# EAGLE schematic S130068_3HP_ECO (EAGLE 6.5.0)

## Sheet 1 of 4
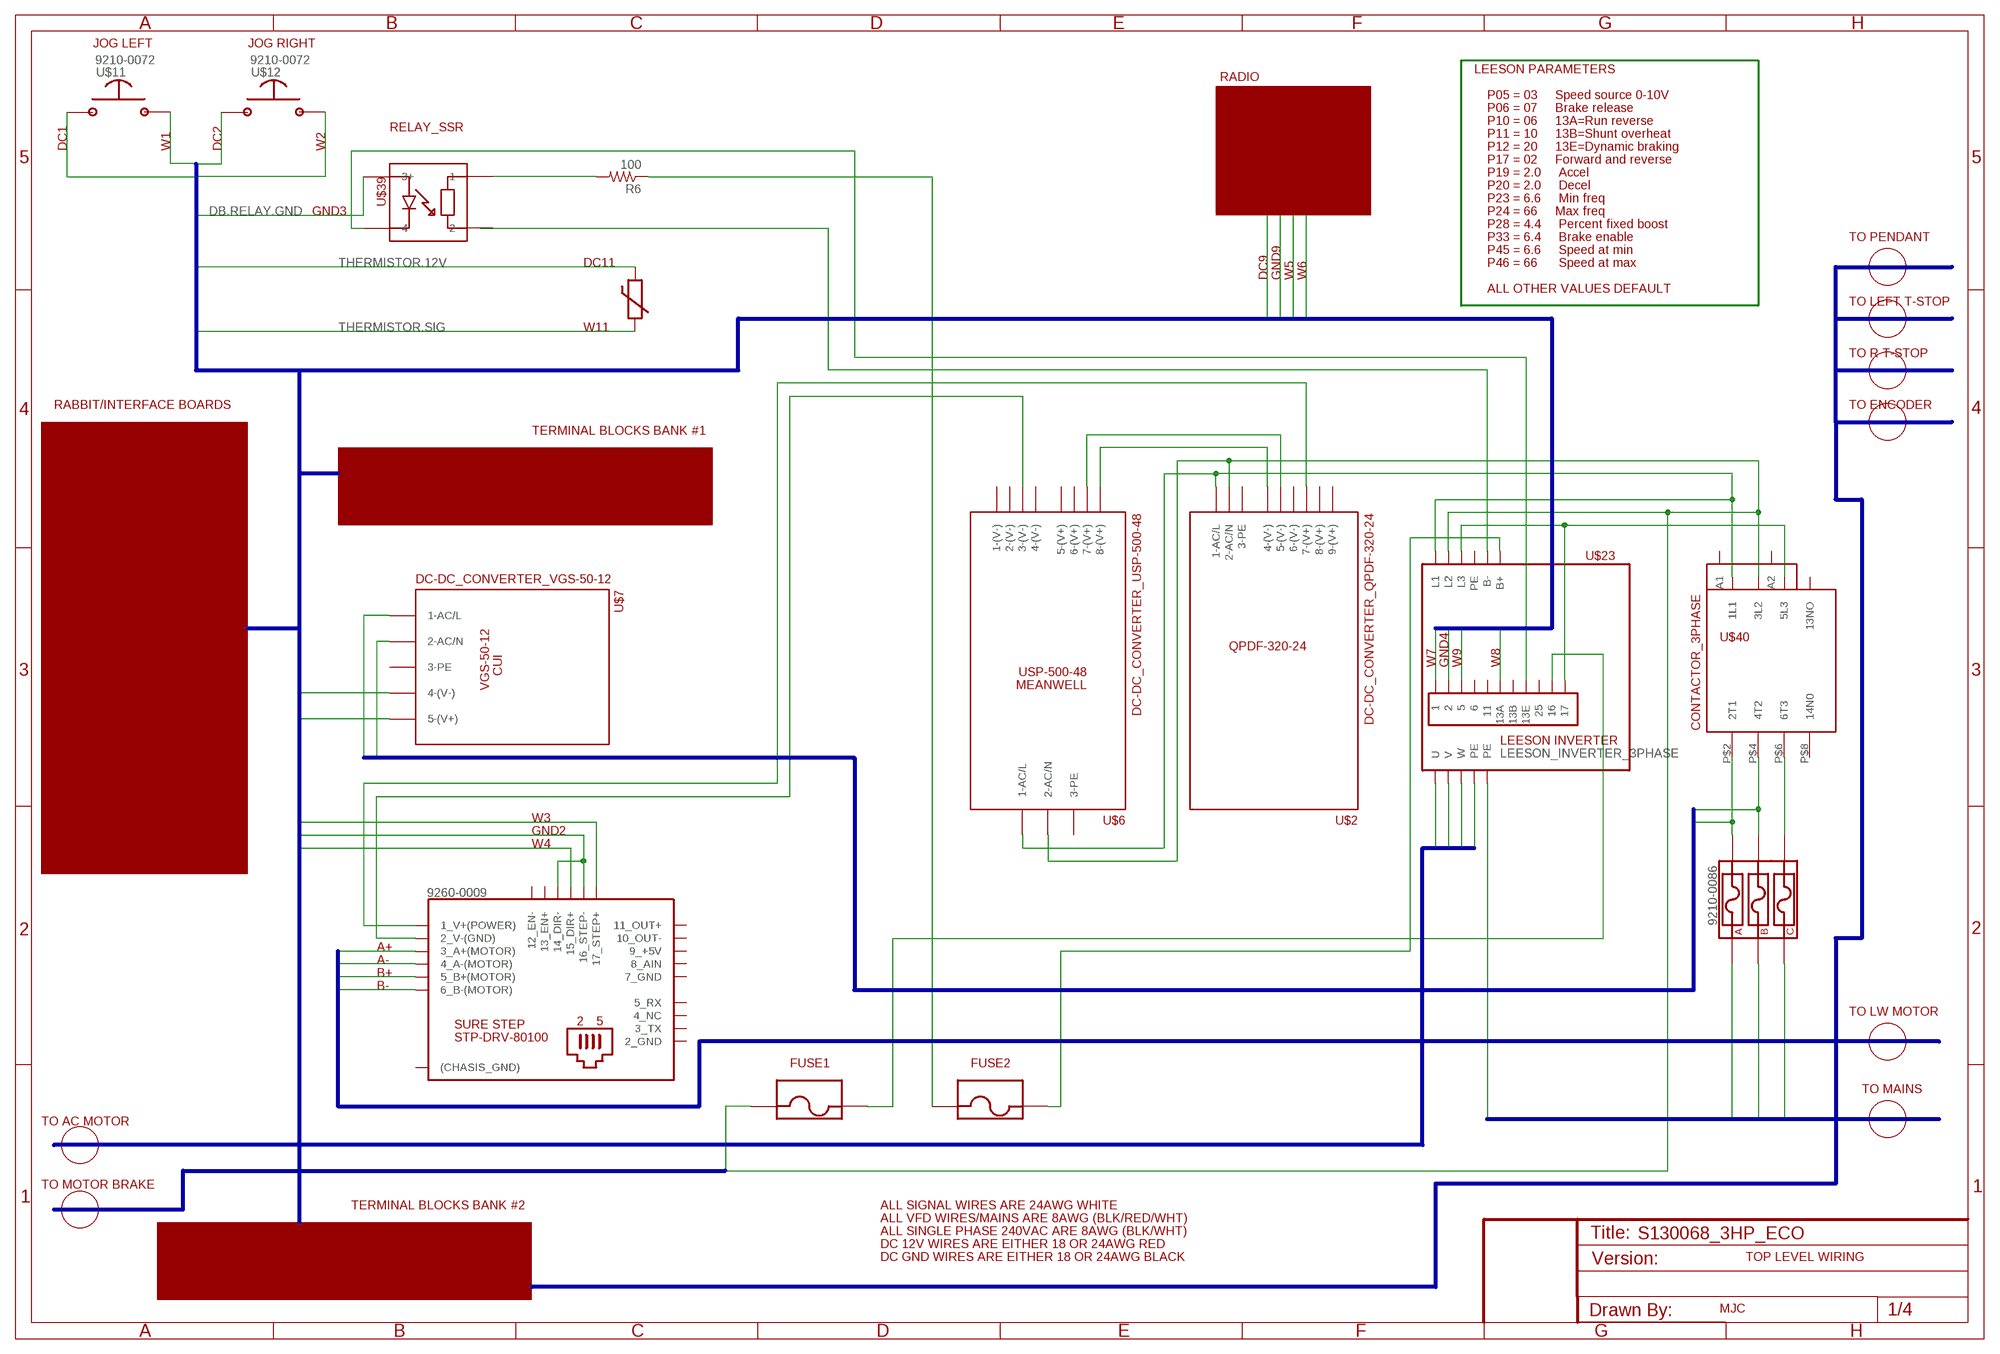
[diagram p0: schematic, sheet 1]

### Parts
R6  100  R-US_V234/12  [V234/12]
U$2  DC-DC_CONVERTER_QPDF-320-24  [BOGUS]
U$6  DC-DC_CONVERTER_USP-500-48  [BOGUS]
U$7  DC-DC_CONVERTER_VGS-50-12  [BOGUS]
U$8  THERMISTOR  [BOGUS]
U$9  TERMINAL_BLOCK_FUSED  [BOGUS]
U$10  TERMINAL_BLOCK_FUSED  [BOGUS]
U$11  SWITCH_MOM_NO  [BOGUS]
U$12  SWITCH_MOM_NO  [BOGUS]
U$13  SURE_STEP_STP-DRV-80100  [BOGUS]
U$23  LEESON_INVERTER_3PHASE  [BOGUS]
U$38  FUSE_HOLDER_3-POLE  [BOGUS]
U$39  RELAY_SSR  [BOGUS]
U$40  CONTACTOR_3PHASE  [BOGUS]

### Nets
B$1: U$23.P$19(PE) U$38.P$1 U$38.P$2 U$38.P$5
B$2: U$23.P$18(PE) U$23.P$20(U) U$23.P$21(V) U$23.P$22(W)
B$7: U$13.P$4(3_A+(MOTOR)) U$13.P$5(4_A-(MOTOR)) U$13.P$6(5_B+(MOTOR)) U$13.P$7(6_B-(MOTOR))
B$8: U$7.P$1(1-AC/L) U$7.P$2(2-AC/N) U$38.P$3 U$38.P$4 U$40.P$2(2T1) U$40.P$4(4T2)
B$9: U$7.P$4(4-(V-)) U$7.P$5(5-(V+)) U$11.P$1 U$11.P$2 U$12.P$1 U$13.P$15(14_DIR-) U$13.P$16(15_DIR+) U$13.P$17(16_STEP-) U$13.P$18(17_STEP+) U$23.P$1 U$23.P$2 U$23.P$3 U$23.P$6(13A)
B$10: U$2.P$2(2-AC/N) U$6.P$4(2-AC/N) U$9.P$2 U$23.P$15(L2) U$40.P$3(3L2)
DB.RELAY.GND: U$39.P$3(3+) ; also sheet 2
N$4: U$23.P$10 U$23.P$16(L3) U$40.P$5(5L3)
N$11: U$23.P$13(B-)
N$24: U$38.P$6 U$40.P$6(6T3)
N$27: U$2.P$1(1-AC/L) U$6.P$2(1-AC/L) U$23.P$14(L1) U$40.P$1(1L1)
N$31: R6.2 U$39.P$1
N$32: U$2.P$4(4-(V-)) U$6.P$11(8-(V+))
N$33: U$39.P$4
N$34: U$12.P$2
N$35: R6.1 U$10.P$2
N$36: U$10.P$1 U$23.P$12(B+)
N$37: U$9.P$1 U$23.P$9
N$39: U$2.P$5(5-(V-)) U$6.P$10(7-(V+))
N$40: U$2.P$7(7-(V+)) U$13.P$2(1_V+(POWER))
N$41: U$6.P$5(3-(V-)) U$13.P$3(2_V-(GND))
THERMISTOR.12V: U$8.P$2 ; also sheet 2
THERMISTOR.SIG: U$8.P$1 ; also sheet 2,4
Unconnected: U$2.P$3(3-PE) U$2.P$6(6-(V-)) U$2.P$8(8-(V+)) U$2.P$9(9-(V+)) U$6.P$1(1-(V-)) U$6.P$3(2-(V-)) U$6.P$6(3-PE) U$6.P$7(4-(V-)) U$6.P$8(5-(V+)) U$6.P$9(6-(V+)) U$7.P$3(3-PE) U$23.P$4 U$23.P$5 U$23.P$7(13B) U$23.P$8(13E) U$23.P$11 U$39.P$2 U$40.P$7(13NO) U$40.P$8(14N0) U$40.P$9(A1) U$40.P$10(A2)

### Buses
B$1
B$2
B$6
B$7
B$8
B$9
B$10

### Notes on the sheet
- JOG LEFT | JOG RIGHT
- LEESON PARAMETERS
- RADIO
- P05 = 03     Speed source 0-10V
- P06 = 07     Brake release
- P10 = 06     13A=Run reverse
- P11 = 10     13B=Shunt overheat
- DC1 | W1 | DC2 | W2 | P12 = 20     13E=Dynamic braking
- P17 = 02     Forward and reverse
- P19 = 2.0     Accel
- P20 = 2.0     Decel
- P23 = 6.6     Min freq
- GND3 | P24 = 66     Max freq
- P28 = 4.4     Percent fixed boost
- P33 = 6.4     Brake enable | TO PENDANT
- P45 = 6.6     Speed at min
- DC11 | P46 = 66      Speed at max
- DC9 | GND9 | W5 | W6
- ALL OTHER VALUES DEFAULT
- TO LEFT T-STOP
- W11
- TO R T-STOP
- RABBIT/INTERFACE BOARDS | TO ENCODER
- TERMINAL BLOCKS BANK #1
- W7 | GND4 | W9 | W8
- W3
- GND2
- W4
- A+
- A-
- B+
- B-
- TO LW MOTOR
- FUSE1 | FUSE2
- TO MAINS
- TO AC MOTOR
- TO MOTOR BRAKE
- TERMINAL BLOCKS BANK #2 | ALL SIGNAL WIRES ARE 24AWG WHITE
- ALL VFD WIRES/MAINS ARE 8AWG (BLK/RED/WHT)
- ALL SINGLE PHASE 240VAC ARE 8AWG (BLK/WHT)
- DC 12V WIRES ARE EITHER 18 OR 24AWG RED
- DC GND WIRES ARE EITHER 18 OR 24AWG BLACK | TOP LEVEL WIRING
- MJC

## Sheet 2 of 4
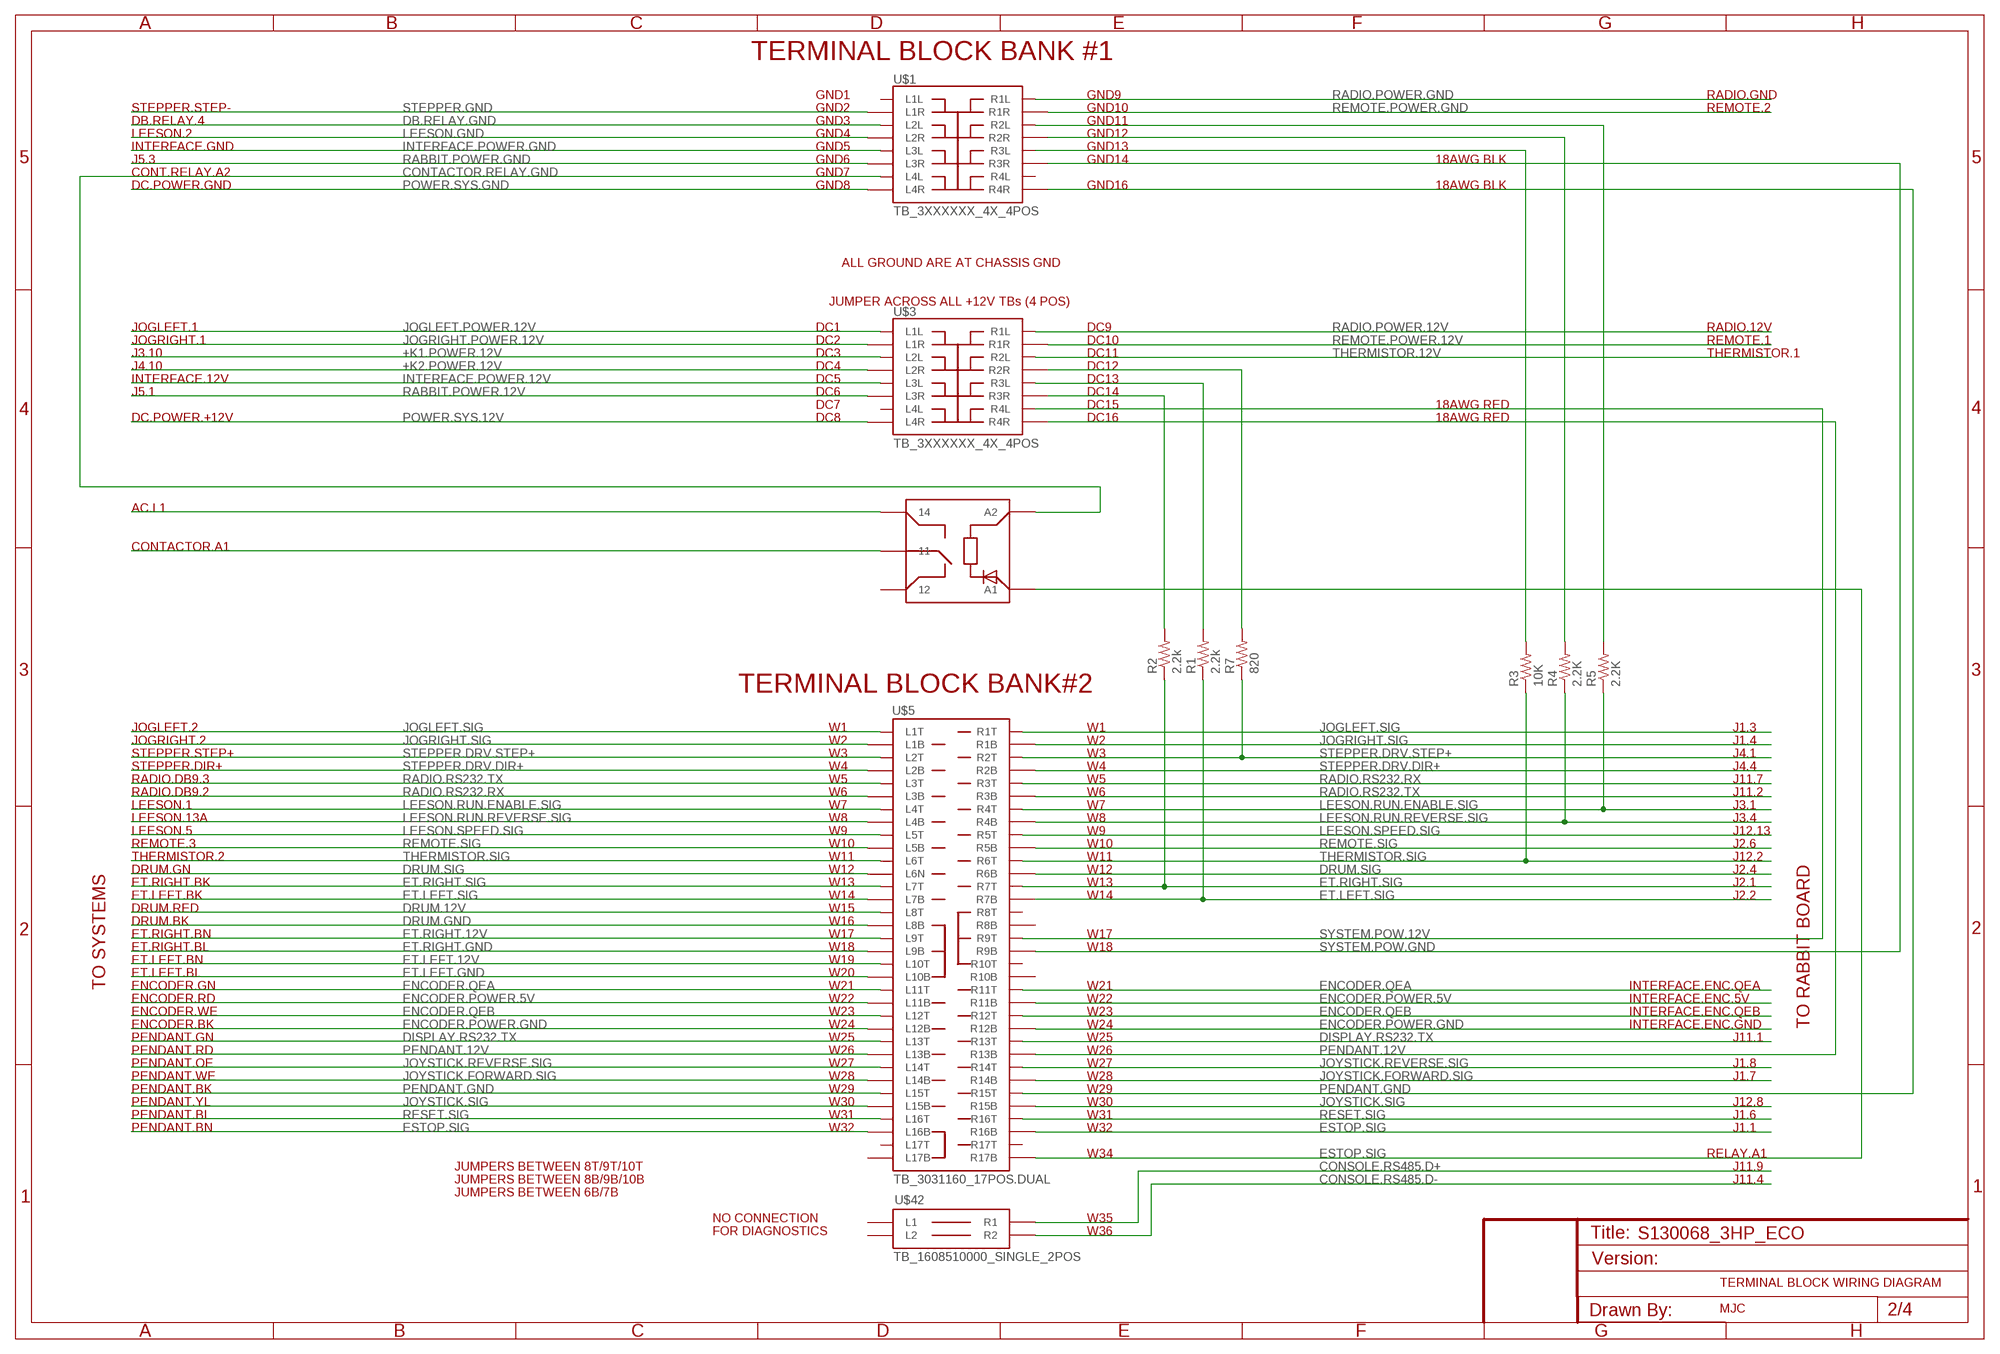
[diagram p1: schematic, sheet 2]

### Parts
R1  2.2k  R-US_V234/12  [V234/12]
R2  2.2k  R-US_V234/12  [V234/12]
R3  10K  R-US_V234/12  [V234/12]
R4  2.2K  R-US_V234/12  [V234/12]
R5  2.2K  R-US_V234/12  [V234/12]
R7  820  R-US_V234/12  [V234/12]
U$1  TB_3XXXXXX_4X_4POS  [BOGUS]
U$3  TB_3XXXXXX_4X_4POS  [BOGUS]
U$4  RELAY_TB  [BOGUS]
U$5  TB_3031160_17POS.DUAL  [BOGUS]
U$42  TB_1608510000_SINGLE_2POS  [BOGUS]

### Nets
+K1.POWER.12V: U$3.P$3(L2L) ; also sheet 4
+K2.POWER.12V: U$3.P$4(L2R) ; also sheet 4
CONSOLE.RS485.D+: U$42.P$3(R1) ; also sheet 4
CONSOLE.RS485.D-: U$42.P$4(R2) ; also sheet 4
CONTACTOR.RELAY.GND: U$1.P$7(L4L) U$4.P$5(A2)
DB.RELAY.GND: U$1.P$3(L2L) ; also sheet 1
DISPLAY.RS232.TX: U$5.P$26(L13T) U$5.P$60(R13T) ; also sheet 3,4
DRUM.12V: U$5.P$16(L8T)
DRUM.GND: U$5.P$15(L8B)
DRUM.SIG: U$5.P$11(L6N) U$5.P$45(R6B) ; also sheet 4
ENCODER.POWER.5V: U$5.P$21(L11B) U$5.P$55(R11B)
ENCODER.POWER.GND: U$5.P$23(L12B) U$5.P$57(R12B)
ENCODER.QEA: U$5.P$22(L11T) U$5.P$56(R11T)
ENCODER.QEB: U$5.P$24(L12T) U$5.P$58(R12T)
ESTOP.SIG: U$4.P$4(A1) U$5.P$31(L16B) U$5.P$65(R16B) U$5.P$67(R17B) ; also sheet 3,4
ET.LEFT.12V: U$5.P$20(L10T)
ET.LEFT.GND: U$5.P$19(L10B)
ET.LEFT.SIG: R1.1 U$5.P$13(L7B) U$5.P$47(R7B) ; also sheet 4
ET.RIGHT.12V: U$5.P$18(L9T)
ET.RIGHT.GND: U$5.P$17(L9B)
ET.RIGHT.SIG: R2.1 U$5.P$14(L7T) U$5.P$48(R7T) ; also sheet 4
INTERFACE.POWER.12V: U$3.P$5(L3L) ; also sheet 4
INTERFACE.POWER.GND: U$1.P$5(L3L) ; also sheet 4
JOGLEFT.POWER.12V: U$3.P$1(L1L)
JOGLEFT.SIG: U$5.P$2(L1T) U$5.P$36(R1T) ; also sheet 4
JOGRIGHT.POWER.12V: U$3.P$2(L1R)
JOGRIGHT.SIG: U$5.P$1(L1B) U$5.P$35(R1B) ; also sheet 4
JOYSTICK.FORWARD.SIG: U$5.P$27(L14B) U$5.P$61(R14B) ; also sheet 3,4
JOYSTICK.REVERSE.SIG: U$5.P$28(L14T) U$5.P$62(R14T) ; also sheet 3,4
JOYSTICK.SIG: U$5.P$29(L15B) U$5.P$63(R15B) ; also sheet 3,4
LEESON.GND: U$1.P$4(L2R)
LEESON.RUN.ENABLE.SIG: R5.1 U$5.P$8(L4T) U$5.P$42(R4T) ; also sheet 4
LEESON.RUN.REVERSE.SIG: R4.1 U$5.P$7(L4B) U$5.P$41(R4B) ; also sheet 4
LEESON.SPEED.SIG: U$5.P$10(L5T) U$5.P$44(R5T) ; also sheet 4
N$2: R2.2 U$3.P$14(R3R)
N$3: R1.2 U$3.P$13(R3L)
N$5: R7.2 U$3.P$12(R2R)
N$6: R3.2 U$1.P$13(R3L)
N$7: R4.2 U$1.P$12(R2R)
N$8: R5.2 U$1.P$11(R2L)
N$9: U$4.P$3
N$10: U$4.P$1
PENDANT.12V: U$3.P$16(R4R) U$5.P$25(L13B) U$5.P$59(R13B) ; also sheet 3
PENDANT.GND: U$1.P$16(R4R) U$5.P$30(L15T) U$5.P$64(R15T) ; also sheet 3
POWER.SYS.12V: U$3.P$8(L4R)
POWER.SYS.GND: U$1.P$8(L4R)
RABBIT.POWER.12V: U$3.P$6(L3R) ; also sheet 4
RABBIT.POWER.GND: U$1.P$6(L3R) ; also sheet 4
RADIO.POWER.12V: U$3.P$9(R1L)
RADIO.POWER.GND: U$1.P$9(R1L)
RADIO.RS232.RX: U$5.P$5(L3B) U$5.P$40(R3T) ; also sheet 4
RADIO.RS232.TX: U$5.P$6(L3T) U$5.P$39(R3B) ; also sheet 4
REMOTE.POWER.12V: U$3.P$10(R1R)
REMOTE.POWER.GND: U$1.P$10(R1R)
REMOTE.SIG: U$5.P$9(L5B) U$5.P$43(R5B) ; also sheet 4
RESET.SIG: U$5.P$32(L16T) U$5.P$66(R16T) ; also sheet 3,4
STEPPER.DRV.DIR+: U$5.P$3(L2B) U$5.P$37(R2B) ; also sheet 4
STEPPER.DRV.STEP+: R7.1 U$5.P$4(L2T) U$5.P$38(R2T) ; also sheet 4
STEPPER.GND: U$1.P$2(L1R)
SYSTEM.POW.12V: U$3.P$15(R4L) U$5.P$52(R9T)
SYSTEM.POW.GND: U$1.P$14(R3R) U$5.P$51(R9B)
THERMISTOR.12V: U$3.P$11(R2L) ; also sheet 1
THERMISTOR.SIG: R3.1 U$5.P$12(L6T) U$5.P$46(R6T) ; also sheet 1,4
Unconnected: U$1.P$1(L1L) U$1.P$15(R4L) U$3.P$7(L4L) U$4.P$2 U$5.P$33(L17B) U$5.P$34(L17T) U$5.P$49(R8B) U$5.P$50(R8T) U$5.P$53(R10B) U$5.P$54(R10T) U$5.P$68(R17T) U$42.P$1(L1) U$42.P$2(L2)

### Notes on the sheet
- TERMINAL BLOCK BANK #1
- GND1 | GND9 | RADIO.GND
- STEPPER.STEP- | GND2 | GND10 | REMOTE.2
- DB.RELAY.4 | GND3 | GND11
- LEESON.2 | GND4 | GND12
- INTERFACE.GND | GND5 | GND13
- J5.3 | GND6 | GND14 | 18AWG BLK
- CONT.RELAY.A2 | GND7
- DC.POWER.GND | GND8 | GND16 | 18AWG BLK
- ALL GROUND ARE AT CHASSIS GND
- JUMPER ACROSS ALL +12V TBs (4 POS)
- JOGLEFT.1 | DC1 | DC9 | RADIO.12V
- JOGRIGHT.1 | DC2 | DC10 | REMOTE.1
- J3.10 | DC3 | DC11 | THERMISTOR.1
- J4.10 | DC4 | DC12
- INTERFACE.12V | DC5 | DC13
- J5.1 | DC6 | DC14
- DC7 | DC15 | 18AWG RED
- DC.POWER.+12V | DC8 | DC16 | 18AWG RED
- AC.L1
- CONTACTOR.A1
- TERMINAL BLOCK BANK#2
- JOGLEFT.2 | W1 | W1 | J1.3
- JOGRIGHT.2 | W2 | W2 | J1.4
- STEPPER.STEP+ | W3 | W3 | J4.1
- STEPPER.DIR+ | W4 | W4 | J4.4
- RADIO.DB9.3 | W5 | W5 | J11.7
- RADIO.DB9.2 | W6 | W6 | J11.2
- LEESON.1 | W7 | W7 | J3.1
- LEESON.13A | W8 | W8 | J3.4
- LEESON.5 | W9 | W9 | J12.13
- REMOTE.3 | W10 | W10 | J2.6
- THERMISTOR.2 | W11 | W11 | J12.2
- DRUM.GN | W12 | W12 | J2.4
- ET.RIGHT.BK | W13 | W13 | J2.1
- ET.LEFT.BK | W14 | W14 | J2.2
- DRUM.RED | W15
- DRUM.BK | W16
- ET.RIGHT.BN | W17 | W17
- ET.RIGHT.BL | W18 | W18
- ET.LEFT.BN | W19
- ET.LEFT.BL | W20
- TO SYSTEMS | ENCODER.GN | W21 | W21 | INTERFACE.ENC.QEA
- ENCODER.RD | W22 | W22 | INTERFACE.ENC.5V
- ENCODER.WE | W23 | W23 | INTERFACE.ENC.QEB
- ENCODER.BK | W24 | W24 | INTERFACE.ENC.GND | TO RABBIT BOARD
- PENDANT.GN | W25 | W25 | J11.1
- PENDANT.RD | W26 | W26
- PENDANT.OE | W27 | W27 | J1.8
- PENDANT.WE | W28 | W28 | J1.7
- PENDANT.BK | W29 | W29
- PENDANT.YL | W30 | W30 | J12.8
- PENDANT.BL | W31 | W31 | J1.6
- PENDANT.BN | W32 | W32 | J1.1
- W34 | RELAY.A1
- JUMPERS BETWEEN 8T/9T/10T | J11.9
- JUMPERS BETWEEN 8B/9B/10B | J11.4
- JUMPERS BETWEEN 6B/7B
- NO CONNECTION | W35
- FOR DIAGNOSTICS | W36
- TERMINAL BLOCK WIRING DIAGRAM
- MJC

## Sheet 3 of 4
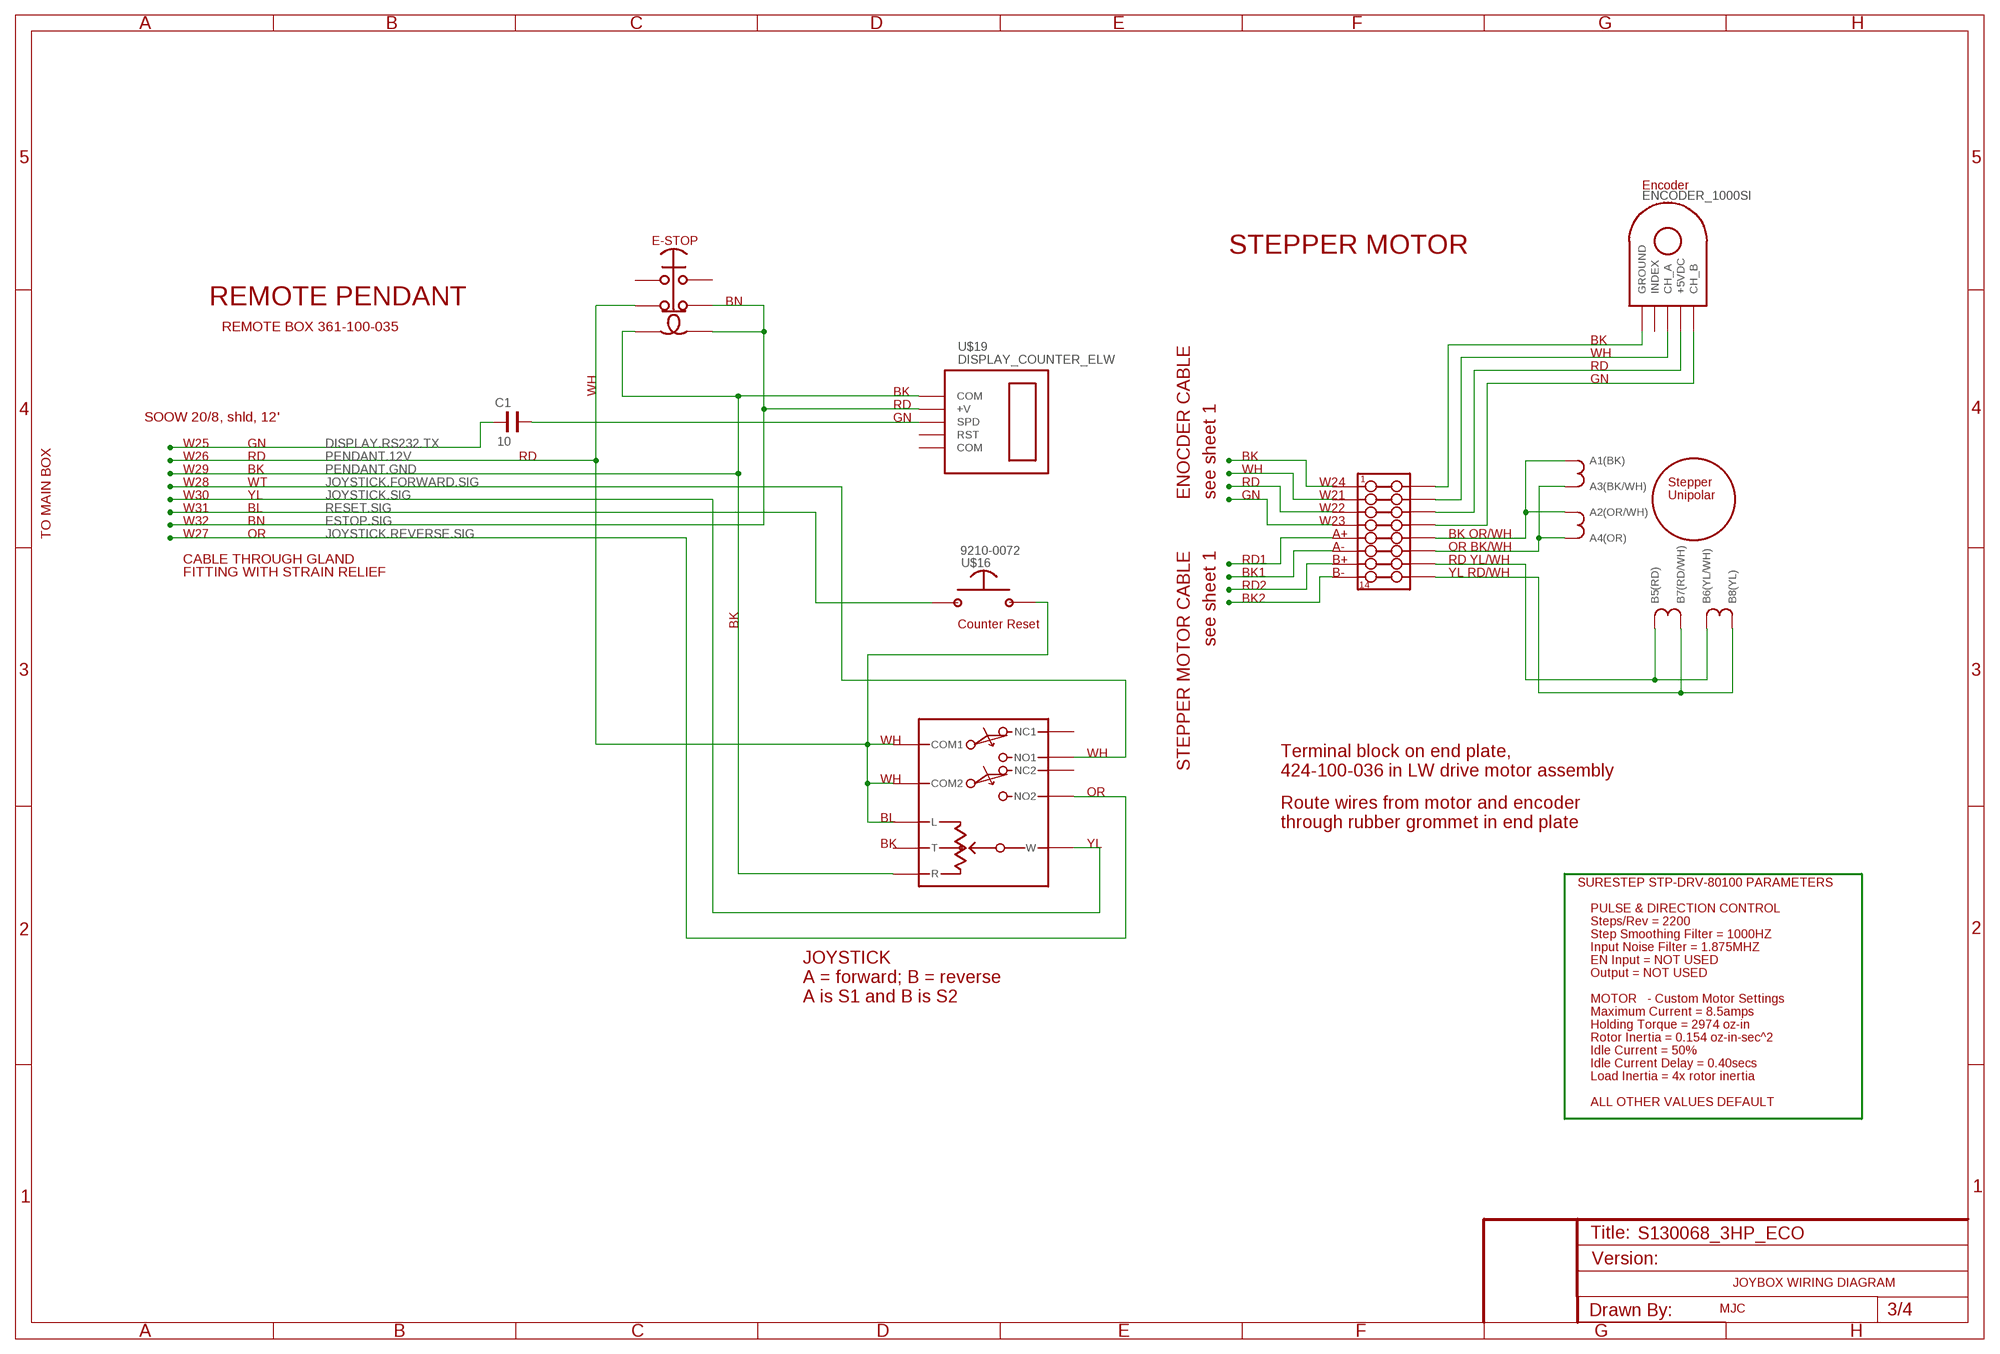
[diagram p2: schematic, sheet 3]

### Parts
C1  10  C0805  [R0805]
U$16  Counter Reset  SWITCH_MOM_NO  [BOGUS]
U$17  SWITCH_ESTOP_LIGHTED  [BOGUS]
U$18  JOYSTICK_PRO-5  [BOGUS]
U$19  DISPLAY_COUNTER_ELW  [BOGUS]
U$20  TERMINAL_BLOCK_8  [BOGUS]
U$21  MOTOR_STEPPER_UNIPOLAR  [BOGUS]
U$22  ENCODER_1000SI  [BOGUS]

### Nets
DISPLAY.RS232.TX: C1.1 ; also sheet 2,4
ESTOP.SIG: U$17.P$4 U$17.P$6 U$19.P$1(+V) ; also sheet 2,4
JOYSTICK.FORWARD.SIG: U$18.P$6(NO1) ; also sheet 2,4
JOYSTICK.REVERSE.SIG: U$18.P$7(NO2) ; also sheet 2,4
JOYSTICK.SIG: U$18.P$10(W) ; also sheet 2,4
N$23: C1.2 U$19.P$5(SPD)
N$77: U$16.P$1
N$81: U$20.P$12 U$21.P$1(A1(BK)) U$21.P$2(A2(OR/WH))
N$88: U$20.P$11 U$21.P$3(A3(BK/WH)) U$21.P$4(A4(OR))
N$89: U$20.P$9 U$21.P$7(B7(RD/WH)) U$21.P$8(B8(YL))
N$91: U$20.P$10 U$21.P$5(B5(RD)) U$21.P$6(B6(YL/WH))
N$92: U$20.P$16 U$22.P$4(GROUND)
N$93: U$20.P$15 U$22.P$2(CH_A)
N$94: U$20.P$14 U$22.P$1(+5VDC)
N$95: U$20.P$13 U$22.P$3(CH_B)
N$96: U$20.P$1
N$97: U$20.P$2
N$98: U$20.P$3
N$99: U$20.P$4
N$100: U$20.P$8
N$101: U$20.P$7
N$102: U$20.P$6
N$103: U$20.P$5
PENDANT.12V: U$16.P$2 U$17.P$2 U$18.P$1(COM1) U$18.P$2(COM2) U$18.P$3(L) ; also sheet 2
PENDANT.GND: U$17.P$5 U$18.P$8(R) U$19.P$2(COM) ; also sheet 2
Unconnected: U$17.P$1 U$17.P$3 U$18.P$4(NC1) U$18.P$5(NC2) U$18.P$9(T) U$19.P$3(COM) U$19.P$4(RST) U$22.P$5(INDEX)

### Notes on the sheet
- STEPPER MOTOR
- REMOTE PENDANT | BN
- REMOTE BOX 361-100-035
- BK
- WH
- RD
- GN
- WH | BK
- RD
- SOOW 20/8, shld, 12' | GN
- TO MAIN BOX | W25 | GN
- W26 | RD | RD | BK
- W29 | BK | WH
- W28 | WT | RD | W24
- W30 | YL | ENOCDER CABLE | see sheet 1 | GN | W21
- W31 | BL | W22
- W32 | BN | W23
- W27 | OR | A+ | BK OR/WH
- STEPPER MOTOR CABLE | see sheet 1 | A- | OR BK/WH
- CABLE THROUGH GLAND | RD1 | B+ | RD YL/WH
- FITTING WITH STRAIN RELIEF | BK1 | B- | YL RD/WH
- RD2
- BK2
- BK | Counter Reset
- WH
- WH | Terminal block on end plate,
- 424-100-036 in LW drive motor assembly
- WH
- OR
- Route wires from motor and encoder
- BL
- through rubber grommet in end plate
- BK | YL
- SURESTEP STP-DRV-80100 PARAMETERS
- PULSE & DIRECTION CONTROL
- Steps/Rev = 2200
- Step Smoothing Filter = 1000HZ
- Input Noise Filter = 1.875MHZ
- JOYSTICK | EN Input = NOT USED
- Output = NOT USED
- A = forward; B = reverse
- A is S1 and B is S2 | MOTOR   - Custom Motor Settings
- Maximum Current = 8.5amps
- Holding Torque = 2974 oz-in
- Rotor Inertia = 0.154 oz-in-sec^2
- Idle Current = 50%
- Idle Current Delay = 0.40secs
- Load Inertia = 4x rotor inertia
- ALL OTHER VALUES DEFAULT
- JOYBOX WIRING DIAGRAM
- MJC

## Sheet 4 of 4
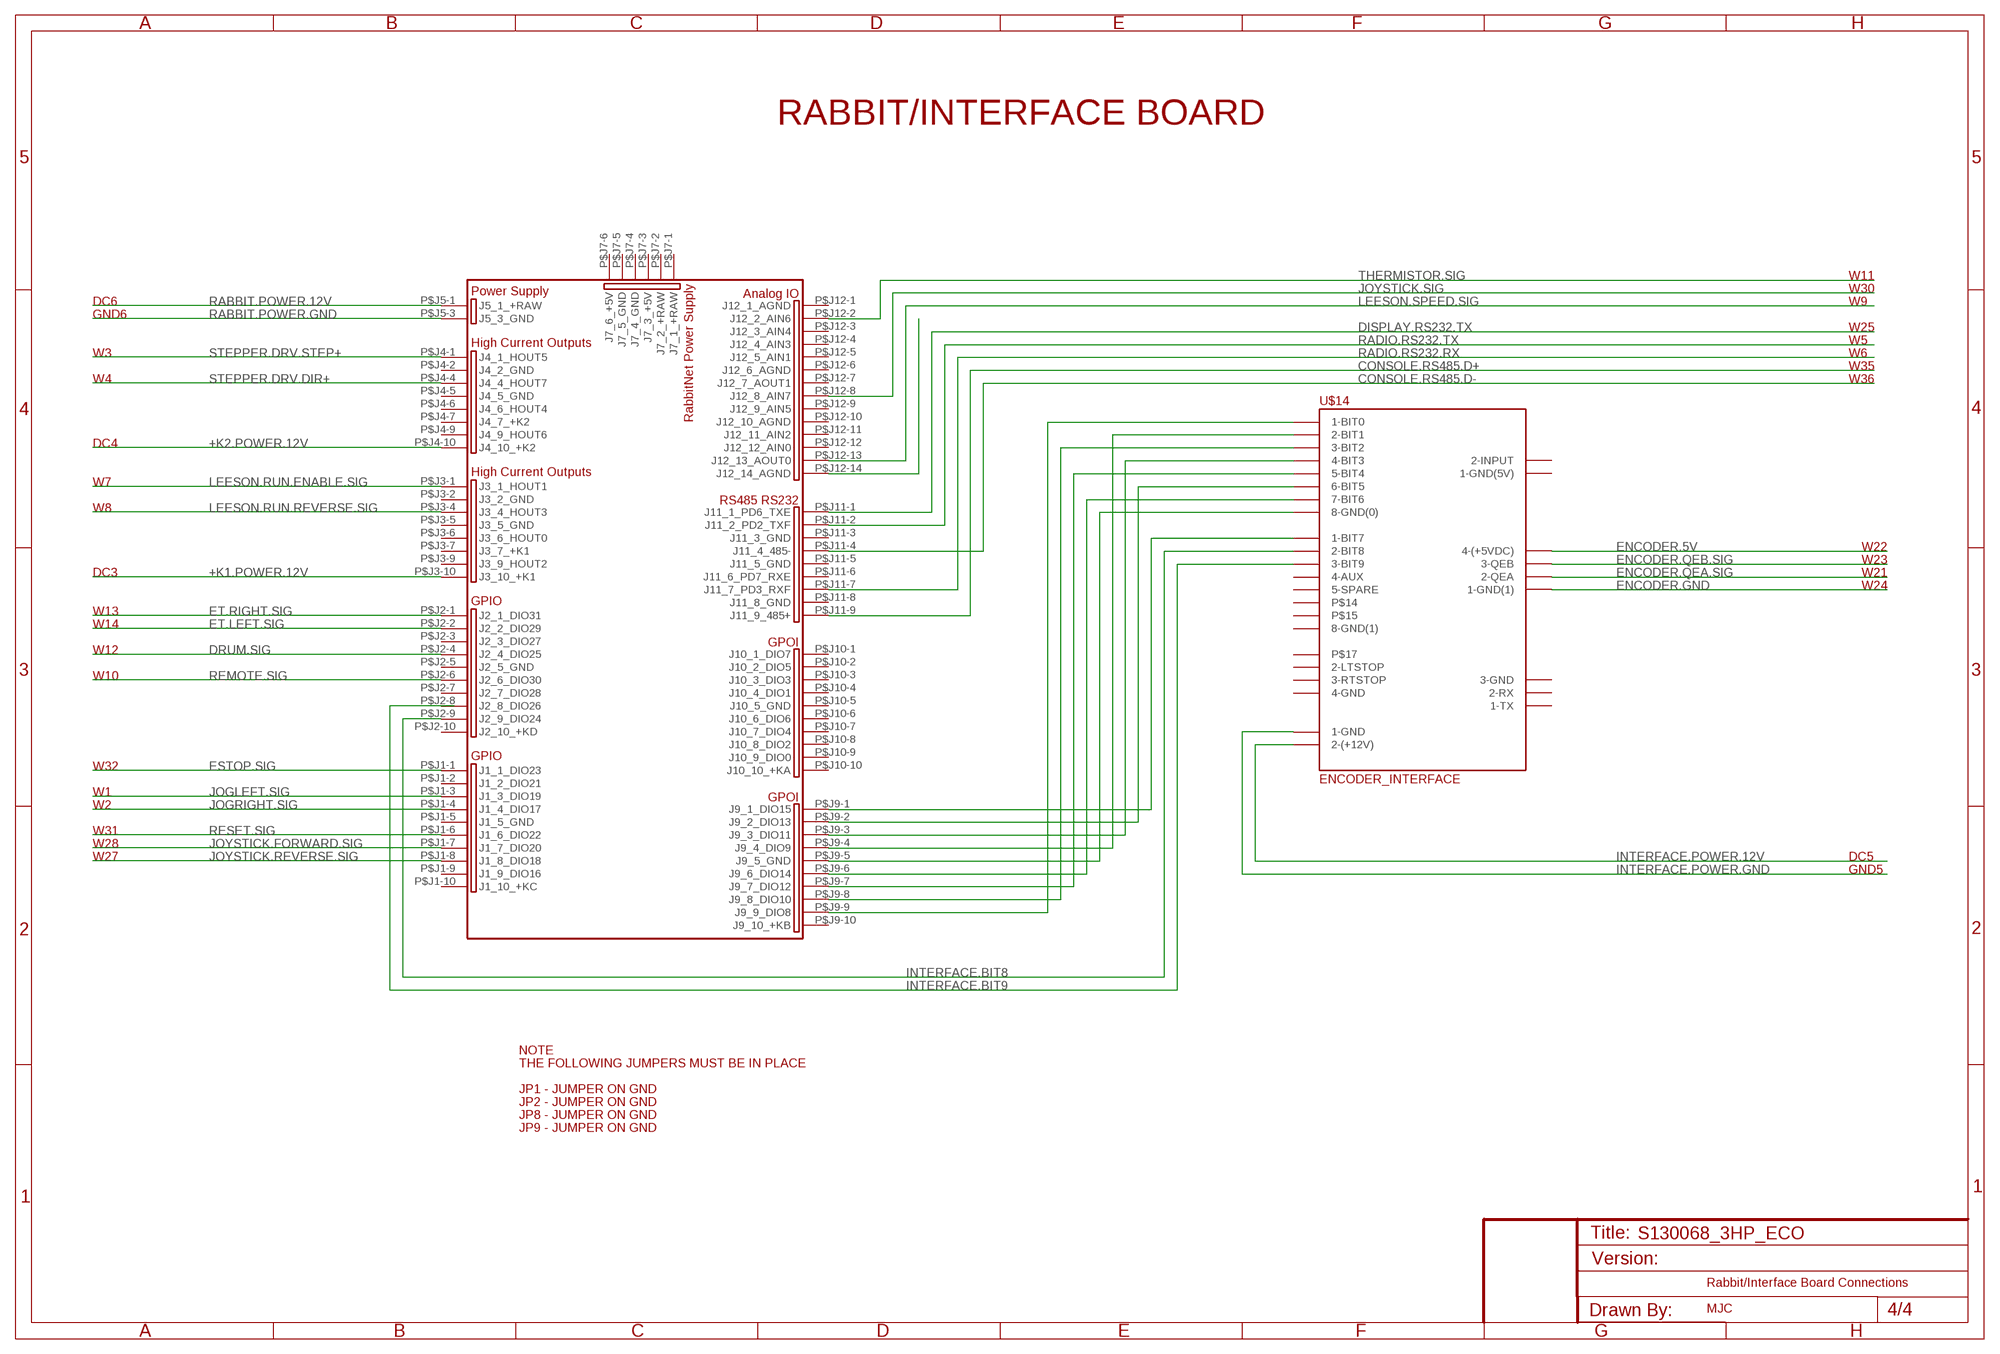
[diagram p3: schematic, sheet 4]

### Parts
U$14  ENCODER_INTERFACE  [BOGUS]
U$15  RABBIT_BL4S200(RCM4310)  [RABBIT_BL4S200]

### Nets
+K1.POWER.12V: U$15.P$J3-10(J3_10_+K1) ; also sheet 2
+K2.POWER.12V: U$15.P$J4-10(J4_10_+K2) ; also sheet 2
CONSOLE.RS485.D+: U$15.P$J11-9(J11_9_485+) ; also sheet 2
CONSOLE.RS485.D-: U$15.P$J11-4(J11_4_485-) ; also sheet 2
DISPLAY.RS232.TX: U$15.P$J11-1(J11_1_PD6_TXE) ; also sheet 2,3
DRUM.SIG: U$15.P$J2-4(J2_4_DIO25) ; also sheet 2
ENCODER.5V: U$14.P$19(4-(+5VDC))
ENCODER.GND: U$14.P$4(1-GND(1))
ENCODER.QEA.SIG: U$14.P$12(2-QEA)
ENCODER.QEB.SIG: U$14.P$17(3-QEB)
ESTOP.SIG: U$15.P$J1-1(J1_1_DIO23) ; also sheet 2,3
ET.LEFT.SIG: U$15.P$J2-2(J2_2_DIO29) ; also sheet 2
ET.RIGHT.SIG: U$15.P$J2-1(J2_1_DIO31) ; also sheet 2
INTERFACE.BIT7: U$14.P$2(1-BIT7) U$15.P$J9-1(J9_1_DIO15)
INTERFACE.BIT8: U$14.P$9(2-BIT8) U$15.P$J2-9(J2_9_DIO24)
INTERFACE.BIT9: U$14.P$15(3-BIT9)
INTERFACE.GND: U$14.P$27(8-GND(0)) U$15.P$J9-5(J9_5_GND)
INTERFACE.POWER.12V: U$14.P$7(2-(+12V)) ; also sheet 2
INTERFACE.POWER.GND: U$14.P$3(1-GND) ; also sheet 2
JOGLEFT.SIG: U$15.P$J1-3(J1_3_DIO19) ; also sheet 2
JOGRIGHT.SIG: U$15.P$J1-4(J1_4_DIO17) ; also sheet 2
JOYSTICK.FORWARD.SIG: U$15.P$J1-7(J1_7_DIO20) ; also sheet 2,3
JOYSTICK.REVERSE.SIG: U$15.P$J1-8(J1_8_DIO18) ; also sheet 2,3
JOYSTICK.SIG: U$15.P$J12-8(J12_8_AIN7) ; also sheet 2,3
LEESON.RUN.ENABLE.SIG: U$15.P$J3-1(J3_1_HOUT1) ; also sheet 2
LEESON.RUN.REVERSE.SIG: U$15.P$J3-4(J3_4_HOUT3) ; also sheet 2
LEESON.SPEED.GND: U$15.P$J12-14(J12_14_AGND)
LEESON.SPEED.SIG: U$15.P$J12-13(J12_13_AOUT0) ; also sheet 2
N$1: U$14.P$21(4-BIT3) U$15.P$J9-3(J9_3_DIO11)
N$71: U$14.P$25(6-BIT5) U$15.P$J9-2(J9_2_DIO13)
N$79: U$14.P$8(2-BIT1) U$15.P$J9-4(J9_4_DIO9)
N$80: U$14.P$26(7-BIT6) U$15.P$J9-6(J9_6_DIO14)
N$85: U$14.P$23(5-BIT4) U$15.P$J9-7(J9_7_DIO12)
N$86: U$14.P$14(3-BIT2) U$15.P$J9-8(J9_8_DIO10)
N$90: U$14.P$1(1-BIT0) U$15.P$J9-9(J9_9_DIO8)
RABBIT.POWER.12V: U$15.P$J5-1(J5_1_+RAW) ; also sheet 2
RABBIT.POWER.GND: U$15.P$J5-3(J5_3_GND) ; also sheet 2
RADIO.RS232.RX: U$15.P$J11-7(J11_7_PD3_RXF) ; also sheet 2
RADIO.RS232.TX: U$15.P$J11-2(J11_2_PD2_TXF) ; also sheet 2
REMOTE.SIG: U$15.P$J2-6(J2_6_DIO30) ; also sheet 2
RESET.SIG: U$15.P$J1-6(J1_6_DIO22) ; also sheet 2,3
STEPPER.DRV.DIR+: U$15.P$J4-4(J4_4_HOUT7) ; also sheet 2
STEPPER.DRV.STEP+: U$15.P$J4-1(J4_1_HOUT5) ; also sheet 2
THERMISTOR.SIG: U$15.P$J12-2(J12_2_AIN6) ; also sheet 1,2
Unconnected: U$14.P$5(1-GND(5V)) U$14.P$6(1-TX) U$14.P$10(2-INPUT) U$14.P$11(2-LTSTOP) U$14.P$13(2-RX) U$14.P$16(3-GND) U$14.P$18(3-RTSTOP) U$14.P$20(4-AUX) U$14.P$22(4-GND) U$14.P$24(5-SPARE) U$14.P$29 U$14.P$30 U$14.P$31 U$15.P$J1-2(J1_2_DIO21) U$15.P$J1-5(J1_5_GND) U$15.P$J1-9(J1_9_DIO16) U$15.P$J1-10(J1_10_+KC) U$15.P$J2-3(J2_3_DIO27) U$15.P$J2-5(J2_5_GND) U$15.P$J2-7(J2_7_DIO28) U$15.P$J2-8(J2_8_DIO26) U$15.P$J2-10(J2_10_+KD) U$15.P$J3-2(J3_2_GND) U$15.P$J3-5(J3_5_GND) U$15.P$J3-6(J3_6_HOUT0) U$15.P$J3-7(J3_7_+K1) U$15.P$J3-9(J3_9_HOUT2) U$15.P$J4-2(J4_2_GND) U$15.P$J4-5(J4_5_GND) U$15.P$J4-6(J4_6_HOUT4) U$15.P$J4-7(J4_7_+K2) U$15.P$J4-9(J4_9_HOUT6) U$15.P$J7-1(J7_1_+RAW) U$15.P$J7-2(J7_2_+RAW) U$15.P$J7-3(J7_3_+5V) U$15.P$J7-4(J7_4_GND) U$15.P$J7-5(J7_5_GND) U$15.P$J7-6(J7_6_+5V) U$15.P$J9-10(J9_10_+KB) U$15.P$J10-1(J10_1_DIO7) U$15.P$J10-2(J10_2_DIO5) U$15.P$J10-3(J10_3_DIO3) U$15.P$J10-4(J10_4_DIO1) U$15.P$J10-5(J10_5_GND) U$15.P$J10-6(J10_6_DIO6) U$15.P$J10-7(J10_7_DIO4) U$15.P$J10-8(J10_8_DIO2) U$15.P$J10-9(J10_9_DIO0) U$15.P$J10-10(J10_10_+KA) U$15.P$J11-3(J11_3_GND) U$15.P$J11-5(J11_5_GND) U$15.P$J11-6(J11_6_PD7_RXE) U$15.P$J11-8(J11_8_GND) U$15.P$J12-1(J12_1_AGND) U$15.P$J12-3(J12_3_AIN4) U$15.P$J12-4(J12_4_AIN3) U$15.P$J12-5(J12_5_AIN1) U$15.P$J12-6(J12_6_AGND) U$15.P$J12-7(J12_7_AOUT1) U$15.P$J12-9(J12_9_AIN5) U$15.P$J12-10(J12_10_AGND) U$15.P$J12-11(J12_11_AIN2) U$15.P$J12-12(J12_12_AIN0)

### Notes on the sheet
- RABBIT/INTERFACE BOARD
- W11
- W30
- DC6 | W9
- GND6
- W25
- W5
- W3 | W6
- W35
- W4 | W36
- DC4
- W7
- W8
- W22
- W23
- DC3 | W21
- W24
- W13
- W14
- W12
- W10
- W32
- W1
- W2
- W31
- W28
- W27 | DC5
- GND5
- NOTE
- THE FOLLOWING JUMPERS MUST BE IN PLACE
- JP1 - JUMPER ON GND
- JP2 - JUMPER ON GND
- JP8 - JUMPER ON GND
- JP9 - JUMPER ON GND
- Rabbit/Interface Board Connections
- MJC

## Power pins joined to a net without a drawn wire
2_GND: U$13.P$19(2_GND)
3_TX: U$13.P$20(3_TX)
4_NC: U$13.P$21(4_NC)
5_RX: U$13.P$22(5_RX)
7_GND: U$13.P$8(7_GND)
8-GND(1): U$14.P$28(8-GND(1))
8_AIN: U$13.P$9(8_AIN)
9_+5V: U$13.P$10(9_+5V)
10_OUT-: U$13.P$11(10_OUT-)
11_OUT+: U$13.P$12(11_OUT+)
12_EN-: U$13.P$13(12_EN-)
13_EN+: U$13.P$14(13_EN+)
(CHASIS_GND): U$13.P$1((CHASIS_GND))
PE: U$23.P$17(PE)

## Library data of the parts
C1 = SOSI:C0805; DPN: 10009
R1-R5 R7 = rcl:R-US_: RESISTOR, American symbol
R6 = resistor:R-US_: RESISTOR, American symbol
U$1 U$3 = SOSI-TerminalBlocks:TB_3XXXXXX_4X_4POS
U$2 = DougM-SOSI-Wiring-Diagram.rpt:DC-DC_CONVERTER_QPDF-320-24
U$4 = DougM-SOSI-Wiring-Diagram.rpt:RELAY_TB
U$5 = SOSI-TerminalBlocks:TB_3031160_17POS.DUAL: 17 POSITIONS OF DUAL ROW PC TERMINAL BLOCKS
U$6 = DougM-SOSI-Wiring-Diagram.rpt:DC-DC_CONVERTER_USP-500-48
U$7 = DougM-SOSI-Wiring-Diagram.rpt:DC-DC_CONVERTER_VGS-50-12
U$8 = DougM-SOSI-Wiring-Diagram.rpt:THERMISTOR: (no PN available) (no description available) Soundnine Inc. (no vendor PN available)
U$9 U$10 = DougM-SOSI-Wiring-Diagram.rpt:TERMINAL_BLOCK_FUSED: 9210-0372 7641K943 Modular DIN Rail-Mount Terminal Block DIN 1 & 3, w/ Blown Fuse Indicator, 8mm, 24 VDC McMasterr McMaster 7641K943
U$11 U$12 = DougM-SOSI-Wiring-Diagram.rpt:SWITCH_MOM_NO: 9210-0072 Mouser Part #: 850-59-313 Manufacturer Part #: 59-313
U$13 = DougM-SOSI-Wiring-Diagram.rpt:SURE_STEP_STP-DRV-80100: 9260-0009 STP-DRV-80100 Step Motor Driver, 80 V 10A Sure Step Automation Direct
U$14 = DougM-SOSI-Wiring-Diagram.rpt:ENCODER_INTERFACE
U$15 = DougM.SOSI.Microcontroller:RABBIT_BL4S200(RCM4310): 9210-0442 COMPUTER SINGLE-BOARD BL4S200 Rabbit Semiconductor 20-101-1220 Digi-Key 316-1164-ND
U$16 = DougM-SOSI-Wiring-Diagram:SWITCH_MOM_NO: 9210-0072 Mouser Part #: 850-59-313 Manufacturer Part #: 59-313
U$17 = DougM-SOSI-Wiring-Diagram:SWITCH_ESTOP_LIGHTED: 9210-0045 Switch, Emergency Stop, w/ #800T-XA4 contact block (old #800H-FRXTQH10RA4) Allen Bradley 800H-FRXTQH2RA4
U$18 = DougM-SOSI-Wiring-Diagram:JOYSTICK_PRO-5: 9280-0000 PRO5-202.1085 (w/20k center tap potentiometer) Joystick (Master Switch), w/20k center tap potentiometer J. R. Merritt Controls
U$19 = DougM-SOSI-Wiring-Diagram:DISPLAY_COUNTER_ELW: 9215-0003 12062A-1 Display Board Assy., ECO-ELW line speed/counter Soundnine Inc.
U$20 = DougM-SOSI-Wiring-Diagram:TERMINAL_BLOCK_8: 9210-0073 ESO800/08DSFB CONN TERMINAL STRIP 8MM 8CIRC On Shore Technology Inc Digi-Key ED2999-ND
U$21 = DougM-SOSI-Wiring-Diagram:MOTOR_STEPPER_UNIPOLAR: 9500-0016 34Y214D-LW8-1000SI Stepper Motor with 1000 line encoder Anaheim Automation Kaman Industrial Technologies
U$22 = DougM-SOSI-Wiring-Diagram:ENCODER_1000SI: (no PN) 1000SI Single-Ended Encoder with Index Channel (comes as part of Stepper Motor assembly 9500-0016) Anaheim Automation
U$23 = DougM-SOSI-Wiring-Diagram.rpt:LEESON_INVERTER_3PHASE
U$38 = DougM-SOSI-Wiring-Diagram.rpt:FUSE_HOLDER_3-POLE: 9210-0086 BC6033PQ Fuseholder, Class CC & Class G, 3 pole, 600V, 30A, for 13/32x1 1/2 fuses Cooper/Bussman North Coast Electric
U$39 = DougM-SOSI-Wiring-Diagram.rpt:RELAY_SSR
U$40 = DougM-SOSI-Wiring-Diagram.rpt:CONTACTOR_3PHASE
U$42 = SOSI-TerminalBlocks:TB_1608510000_SINGLE_2POS: 9210-0348